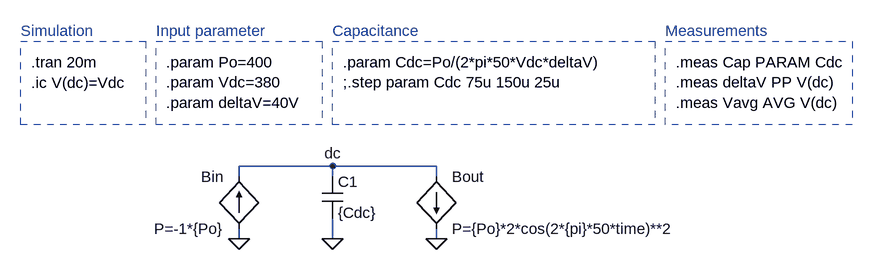
[diagram p0: schematic dc-bus-power-decoupling.asc]
dc-bus-power-decoupling.asc, the LTspice schematic file:
Version 4
SHEET 1 1092 680
WIRE 64 96 -80 96
WIRE 224 96 64 96
WIRE -80 112 -80 96
WIRE 64 112 64 96
WIRE 224 112 224 96
WIRE -80 208 -80 192
WIRE 64 208 64 176
WIRE 224 208 224 192
FLAG 64 208 0
FLAG 64 96 dc
FLAG 224 208 0
FLAG -80 208 0
SYMBOL cap 48 112 R0
SYMATTR InstName C1
SYMATTR Value {Cdc}
SYMBOL bi 224 112 R0
SYMATTR InstName Bout
SYMATTR Value P={Po}*2*cos(2*{pi}*50*time)**2
SYMBOL bi -80 192 R180
WINDOW 0 24 80 Left 2
WINDOW 3 24 0 Left 2
SYMATTR InstName Bin
SYMATTR Value P=-1*{Po}
TEXT -400 -32 Left 2 !.ic V(dc)=Vdc
TEXT -400 -64 Left 2 !.tran 20m
TEXT 592 -64 Left 2 !.meas Cap PARAM Cdc\n.meas deltaV PP V(dc)\n.meas Vavg AVG V(dc)
TEXT -192 -64 Left 2 !.param Po=400\n.param Vdc=380\n.param deltaV=40V
TEXT 80 -64 Left 2 !.param Cdc=Po/(2*pi*50*Vdc*deltaV)\n;.step param Cdc 75u 150u 25u
TEXT -416 -112 Left 2 ;Simulation
TEXT -208 -112 Left 2 ;Input parameter
TEXT 64 -112 Left 2 ;Capacitance
TEXT 576 -112 Left 2 ;Measurements
RECTANGLE Normal 48 32 -208 -96 2
RECTANGLE Normal 560 32 64 -96 2
RECTANGLE Normal -224 32 -416 -96 2
RECTANGLE Normal 864 32 576 -96 2

The netlist it stands for:
* dc-bus-power-decoupling.asc
C1 dc 0 {Cdc}
Bout dc 0 P={Po}*2*cos(2*{pi}*50*time)**2
Bin 0 dc P=-1*{Po}
.ic V(dc)=Vdc
.tran 20m
.meas Cap PARAM Cdc
.meas deltaV PP V(dc)
.meas Vavg AVG V(dc)
.param Po=400
.param Vdc=380
.param deltaV=40V
.param Cdc=Po/(2*pi*50*Vdc*deltaV)
;.step param Cdc 75u 150u 25u
* Simulation
* Input parameter
* Capacitance
* Measurements
.backanno
.end